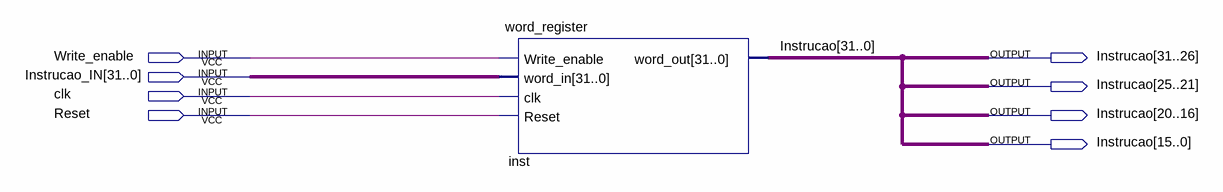
[diagram p0: schematic sheet]
// Quartus schematic Instruction_register.bdf as structural Verilog: 1 symbols, 8 pins
module Instruction_register (
  input  Write_enable,
  input  [31:0] Instrucao_IN,
  input  clk,
  input  Reset,
  output [31:0] Instrucao
);

  word_register inst (
    .Write_enable(Write_enable), .word_in(Instrucao_IN), .clk(clk), .Reset(Reset), .word_out(Instrucao));
endmodule
